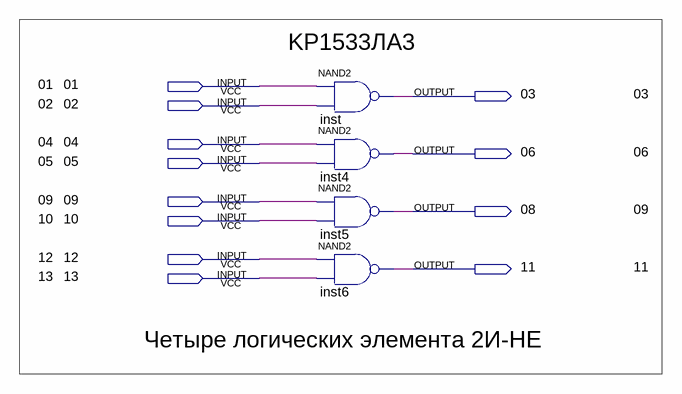
[diagram p0: schematic sheet]
// Quartus schematic KP1533LA3.bdf as structural Verilog: 4 symbols, 12 pins
module KP1533LA3 (
  input  \01 ,
  input  \02 ,
  input  \04 ,
  input  \05 ,
  input  \09 ,
  input  \10 ,
  input  \12 ,
  input  \13 ,
  output \03 ,
  output \06 ,
  output \08 ,
  output \11 
);

  nand inst (\03 , \01 , \02 );
  nand inst4 (\06 , \04 , \05 );
  nand inst5 (\08 , \09 , \10 );
  nand inst6 (\11 , \12 , \13 );

  // Notes on the sheet:
  //   KP1533ЛА3
  //   01
  //   03
  //   02
  //   04
  //   06
  //   05
  //   09
  //   09
  //   10
  //   12
  //   11
  //   13
  //   Четыре логических элемента 2И-НЕ
endmodule
